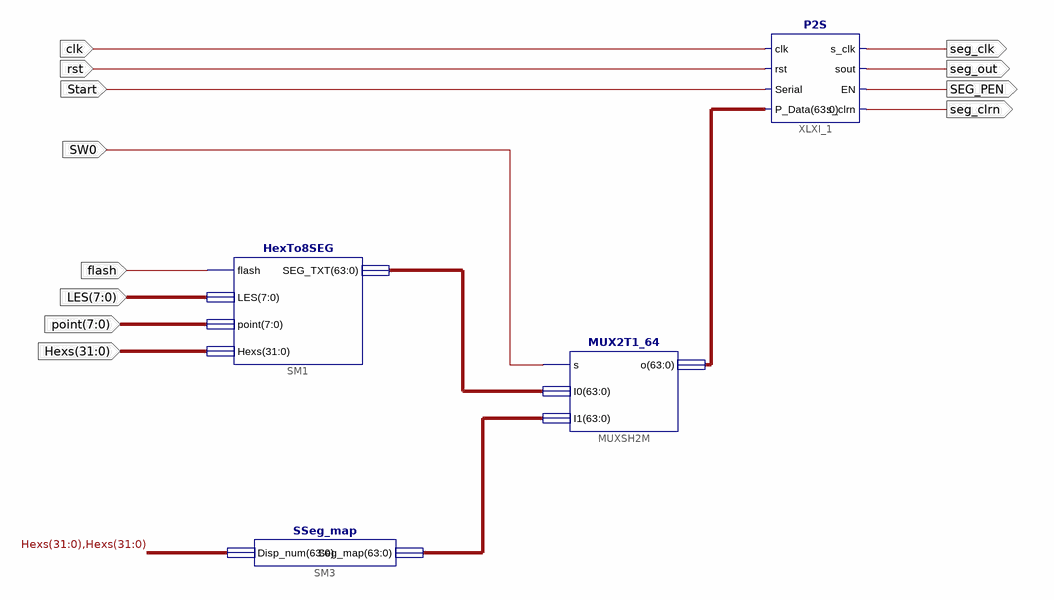
[diagram p0: schematic sheet 1]
// Xilinx ISE schematic SSeg7_Dev.sch (kintex7) as structural Verilog: 4 symbols, 12 ports
module SSeg7_Dev (
  input  [31:0] Hexs,
  input  [7:0] point,
  input  [7:0] LES,
  input  flash,
  input  SW0,
  input  Start,
  input  rst,
  input  clk,
  output seg_clk,
  output seg_out,
  output SEG_PEN,
  output seg_clrn
);

  wire [63:0] XLXN_1, XLXN_2, XLXN_9;

  HexTo8SEG SM1 (.flash(flash), .LES(LES), .point(point), .Hexs(Hexs), .SEG_TXT(XLXN_1));
  SSeg_map SM3 (.Disp_num({Hexs, Hexs}), .Seg_map(XLXN_2));
  MUX2T1_64 MUXSH2M (.s(SW0), .I0(XLXN_1), .I1(XLXN_2), .o(XLXN_9));
  P2S XLXI_1 (
    .s_clrn(seg_clrn), .sout(seg_out), .rst(rst), .EN(SEG_PEN), .Serial(Start), .clk(clk), .s_clk(seg_clk),
    .P_Data(XLXN_9));
endmodule
